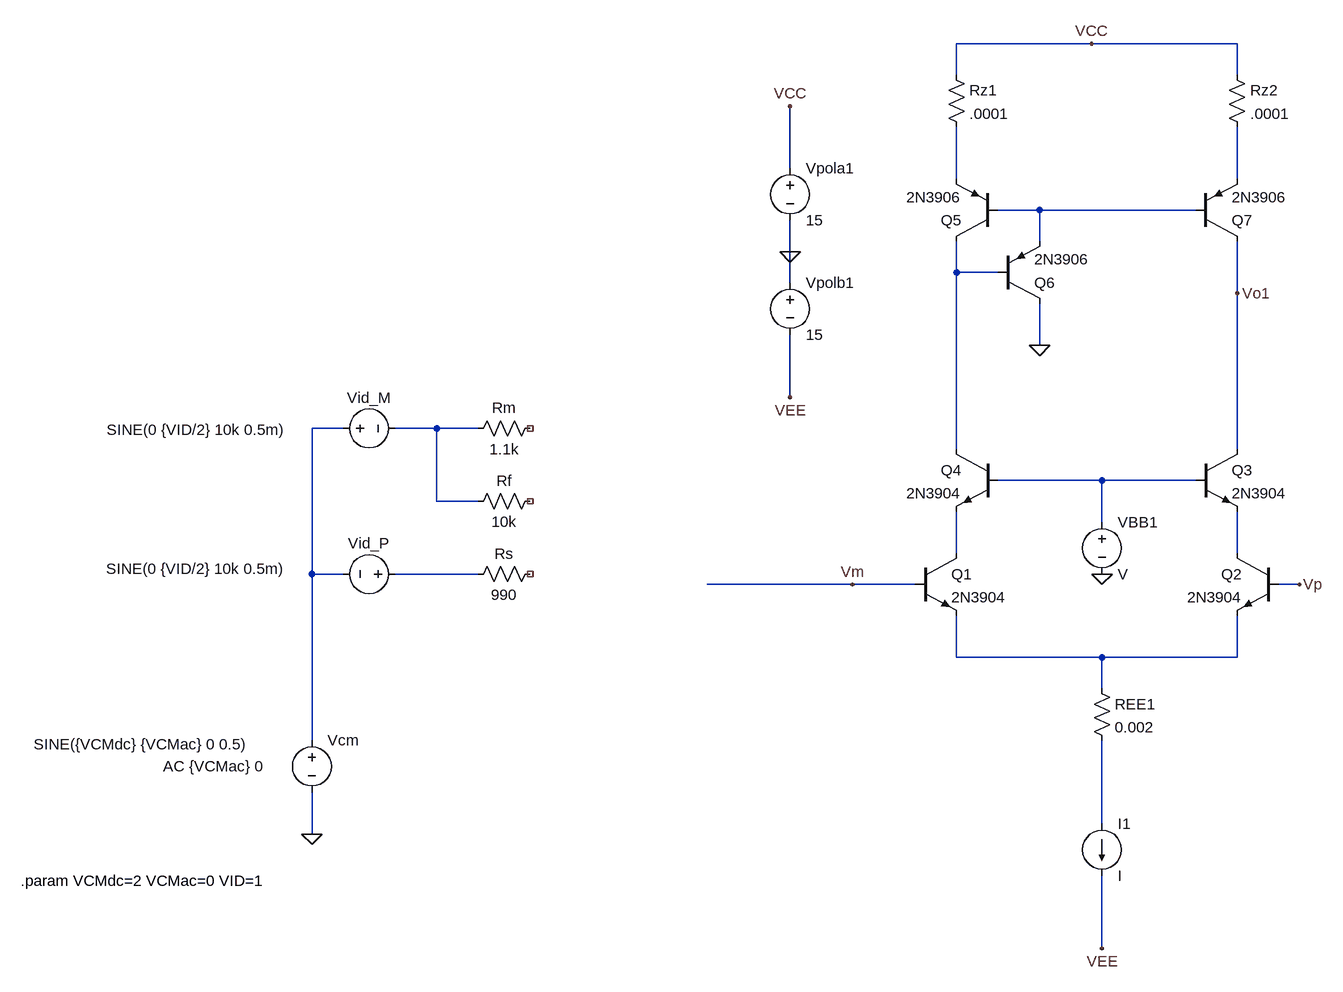
[diagram p0: schematic LT_OPEN_LOOP.asc]
LT_OPEN_LOOP.asc, the LTspice schematic file:
Version 4
SHEET 1 1664 680
WIRE 1264 -864 1056 -864
WIRE 1488 -864 1264 -864
WIRE 1056 -816 1056 -864
WIRE 1488 -816 1488 -864
WIRE 800 -672 800 -768
WIRE 1056 -656 1056 -736
WIRE 1488 -656 1488 -736
WIRE 1184 -608 1120 -608
WIRE 1424 -608 1184 -608
WIRE 1184 -560 1184 -608
WIRE 800 -544 800 -592
WIRE 1056 -512 1056 -560
WIRE 1120 -512 1056 -512
WIRE 800 -496 800 -544
WIRE 1488 -480 1488 -560
WIRE 1184 -400 1184 -464
WIRE 800 -320 800 -416
WIRE 112 -272 64 -272
WIRE 256 -272 192 -272
WIRE 320 -272 256 -272
WIRE 1056 -240 1056 -512
WIRE 1488 -240 1488 -480
WIRE 1280 -192 1120 -192
WIRE 1424 -192 1280 -192
WIRE 256 -160 256 -272
WIRE 320 -160 256 -160
WIRE 1280 -128 1280 -192
WIRE 1056 -80 1056 -144
WIRE 1488 -80 1488 -144
WIRE 64 -48 64 -272
WIRE 112 -48 64 -48
WIRE 320 -48 192 -48
WIRE 896 -32 672 -32
WIRE 992 -32 896 -32
WIRE 1584 -32 1552 -32
WIRE 1056 80 1056 16
WIRE 1280 80 1056 80
WIRE 1488 80 1488 16
WIRE 1488 80 1280 80
WIRE 1280 128 1280 80
WIRE 64 208 64 -48
WIRE 1280 336 1280 208
WIRE 64 352 64 288
WIRE 1280 528 1280 416
FLAG 64 352 0
FLAG 1264 -864 VCC
FLAG 800 -768 VCC
FLAG 800 -320 VEE
FLAG 800 -544 0
FLAG 1488 -480 Vo1
FLAG 1584 -32 Vp
FLAG 896 -32 Vm
FLAG 1184 -400 0
FLAG 1280 -48 0
FLAG 1280 528 VEE
SYMBOL voltage 64 192 R0
WINDOW 3 -428 22 Left 2
WINDOW 123 -229 56 Left 2
WINDOW 39 0 0 Left 0
SYMATTR InstName Vcm
SYMATTR Value SINE({VCMdc} {VCMac} 0 0.5)
SYMATTR Value2 AC {VCMac} 0
SYMBOL voltage 96 -272 R270
WINDOW 0 32 56 VTop 2
WINDOW 3 14 -210 VBottom 2
WINDOW 123 0 0 Left 0
WINDOW 39 0 0 Left 0
SYMATTR InstName Vid_M
SYMATTR Value SINE(0 {VID/2} 10k 0.5m)
SYMBOL voltage 208 -48 M270
WINDOW 0 32 56 VTop 2
WINDOW 3 24 323 VBottom 2
WINDOW 123 0 0 Left 0
WINDOW 39 0 0 Left 0
SYMATTR InstName Vid_P
SYMATTR Value SINE(0 {VID/2} 10k 0.5m)
SYMBOL res 416 -64 R90
WINDOW 0 0 56 VBottom 2
WINDOW 3 32 56 VTop 2
SYMATTR InstName Rs
SYMATTR Value 990
SYMBOL res 416 -288 R90
WINDOW 0 0 56 VBottom 2
WINDOW 3 32 56 VTop 2
SYMATTR InstName Rm
SYMATTR Value 1.1k
SYMBOL res 416 -176 R90
WINDOW 0 0 56 VBottom 2
WINDOW 3 32 56 VTop 2
SYMATTR InstName Rf
SYMATTR Value 10k
SYMBOL npn 992 -80 R0
SYMATTR InstName Q1
SYMATTR Value 2N3904
SYMBOL npn 1552 -80 M0
SYMATTR InstName Q2
SYMATTR Value 2N3904
SYMBOL npn 1424 -240 R0
SYMATTR InstName Q3
SYMATTR Value 2N3904
SYMBOL npn 1120 -240 M0
SYMATTR InstName Q4
SYMATTR Value 2N3904
SYMBOL pnp 1120 -560 R180
SYMATTR InstName Q5
SYMATTR Value 2N3906
SYMBOL pnp 1120 -464 M180
SYMATTR InstName Q6
SYMATTR Value 2N3906
SYMBOL pnp 1424 -560 M180
SYMATTR InstName Q7
SYMATTR Value 2N3906
SYMBOL res 1040 -832 R0
SYMATTR InstName Rz1
SYMATTR Value .0001
SYMBOL res 1472 -832 R0
SYMATTR InstName Rz2
SYMATTR Value .0001
SYMBOL voltage 800 -688 R0
WINDOW 123 0 0 Left 0
WINDOW 39 0 0 Left 0
SYMATTR InstName Vpola1
SYMATTR Value 15
SYMBOL voltage 800 -512 R0
WINDOW 123 0 0 Left 0
WINDOW 39 0 0 Left 0
SYMATTR InstName Vpolb1
SYMATTR Value 15
SYMBOL current 1280 336 R0
SYMATTR InstName I1
SYMBOL voltage 1280 -144 R0
SYMATTR InstName VBB1
SYMBOL res 1264 112 R0
SYMATTR InstName REE1
SYMATTR Value 0.002
TEXT -384 424 Left 2 !.param VCMdc=2 VCMac=0 VID=1

The netlist it stands for:
* LT_OPEN_LOOP.asc
Vcm N005 0 SINE({VCMdc} {VCMac} 0 0.5) AC {VCMac} 0
Vid_M N005 N006 SINE(0 {VID/2} 10k 0.5m)
Vid_P N010 N005 SINE(0 {VID/2} 10k 0.5m)
Rs NC_01 N010 990
Rm NC_02 N006 1.1k
Rf NC_03 N006 10k
Q1 N008 Vm N011 0 2N3904
Q2 N009 Vp N011 0 2N3904
Q3 Vo1 N007 N009 0 2N3904
Q4 N004 N007 N008 0 2N3904
Q5 N004 N003 N001 0 2N3906
Q6 0 N004 N003 0 2N3906
Q7 Vo1 N003 N002 0 2N3906
Rz1 VCC N001 .0001
Rz2 VCC N002 .0001
Vpola1 VCC 0 15
Vpolb1 0 VEE 15
I1 N012 VEE I
VBB1 N007 0 V
REE1 N011 N012 0.002
.model NPN NPN
.model PNP PNP
.lib standard.bjt
.param VCMdc=2 VCMac=0 VID=1
.backanno
.end